# EAGLE schematic main (EAGLE 9.0.1)
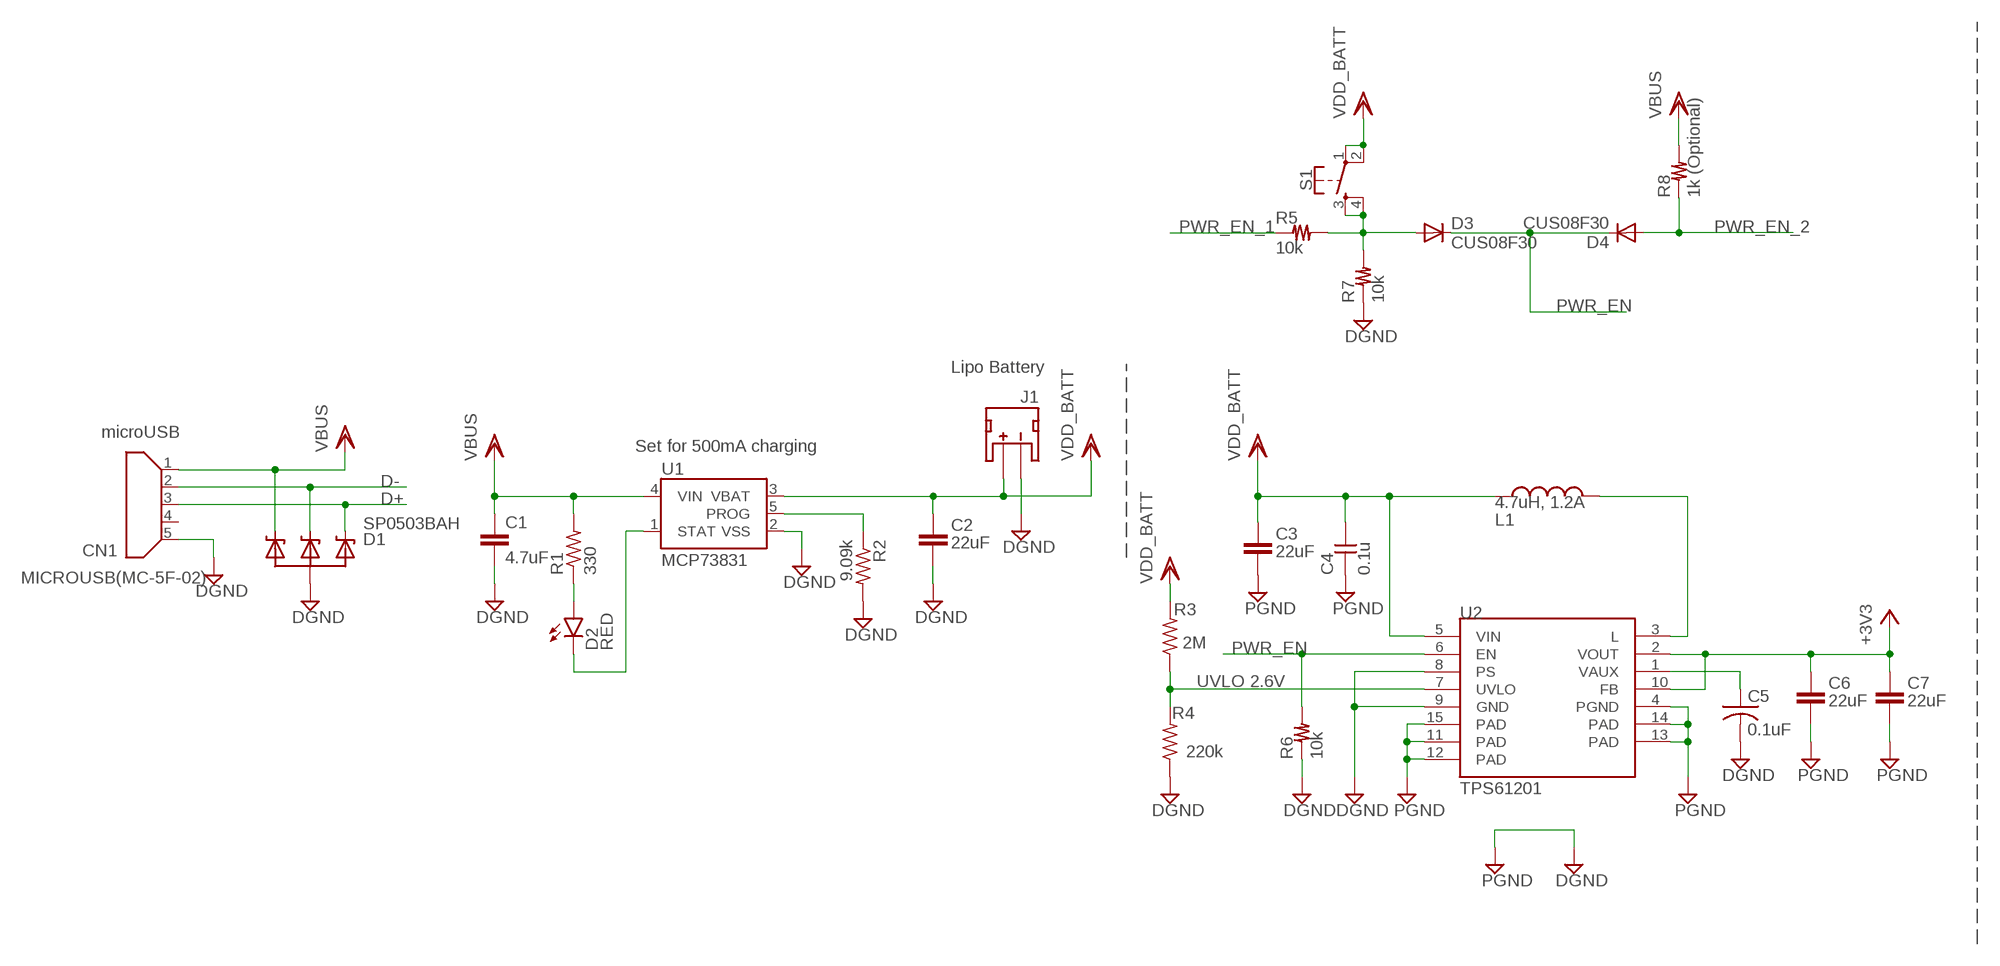
[diagram p0: schematic, sheet 1, part 1 of 2]
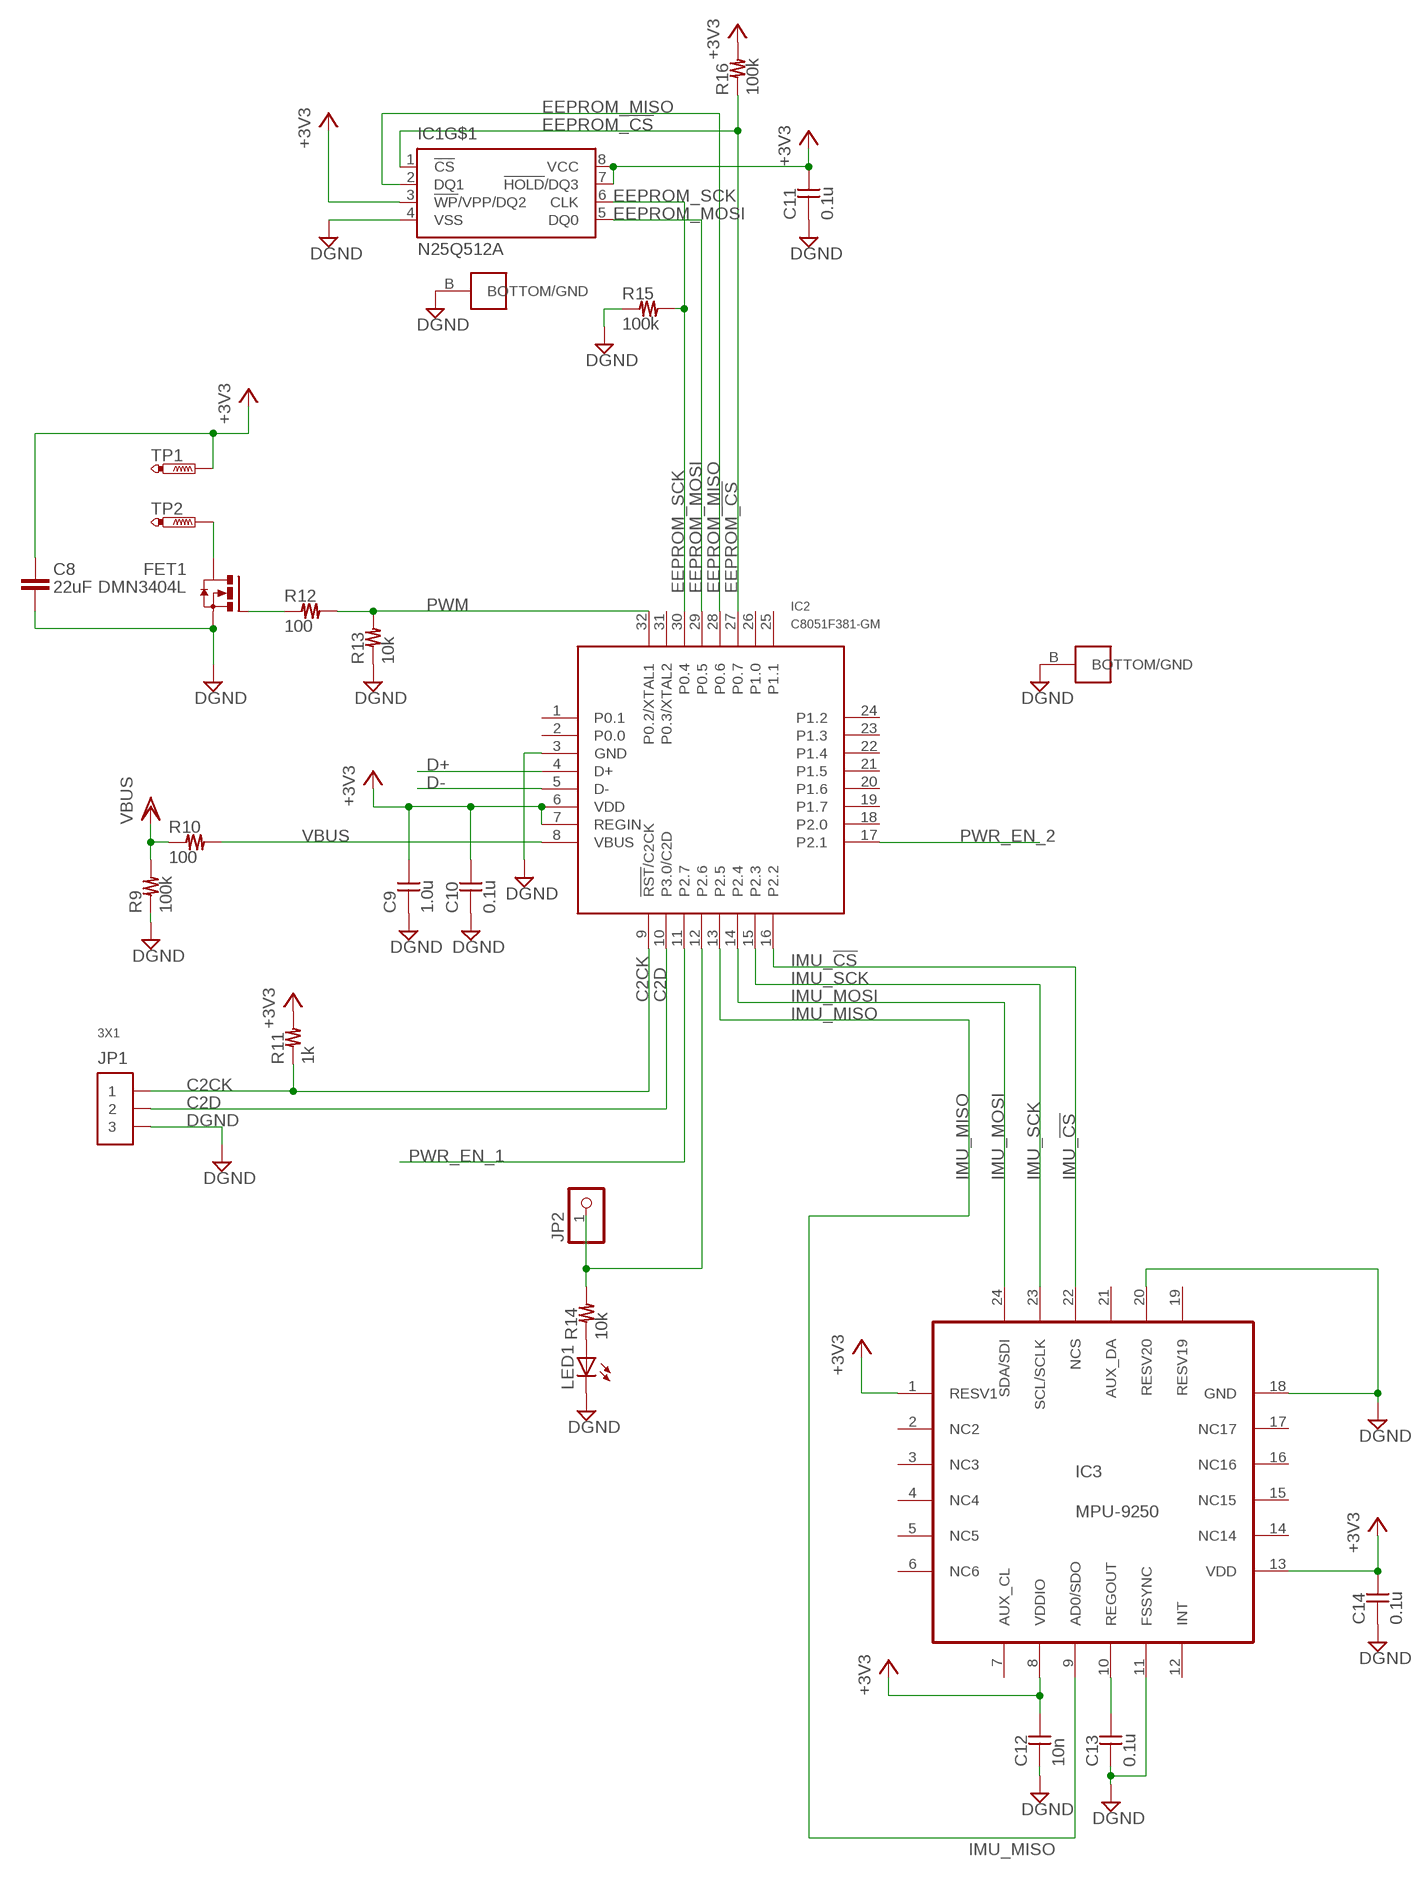
[diagram p1: schematic, sheet 1, part 2 of 2]

## Parts
C1  4.7uF  4.7UF-6.3V-10%(0603)0603  [0603-CAP]
C2  22uF  CAP0805  [0805]
C3  22uF  CAP0805  [0805]
C4  0.1u  C-1005  [1005]
C5  0.1uF  C-USC0402K  [C0402K]
C6  22uF  CAP0805  [0805]
C7  22uF  CAP0805  [0805]
C8  22uF  CAP0805  [0805]
C9  1.0u  C-1005  [1005]
C10  0.1u  C-1005  [1005]
C11  0.1u  C-1005  [1005]
C12  10n  C-1005  [1005]
C13  0.1u  C-1005  [1005]
C14  0.1u  C-1005  [1005]
CN1  MICROUSB(MC-5F-02)  [MICROUSB(MC-5F-02)]
D1  SP0503BAH  [SOT143]
D2  RED  LED-RED0603  [LED-0603]
D3  CUS08F30  DIODE-SOD323-W  [SOD323-W]
D4  CUS08F30  DIODE-SOD323-W  [SOD323-W]
FET1  DMN3404L  [SOT23]
IC1  N25Q512A  [V-PDFN-8]
IC2  C8051F381-GM  [QFN32]
IC3  MPU-9250  [QFN-24]
J1  JST  JST_2MM_MALE  [JST-2-SMD]
JP1  3X1  [MA3-1]
JP2  PINHD-1X1  [1X01]
L1  4.7uH, 1.2A  INDUCTOR.  [CDRH2D09]
LED1  LED1608O  [1608-OLI]
R1  330  R-US_R0402  [R0402]
R2  9.09k  R-US_R0402  [R0402]
R3  2M  R-US_R0402  [R0402]
R4  220k  R-US_R0402  [R0402]
R5  10k  R-1005  [1005]
R6  10k  R-1005  [1005]
R7  10k  R-1005  [1005]
R8  1k (Optional)  R-1005  [1005]
R9  100k  R-1005  [1005]
R10  100  R-1005  [1005]
R11  1k  R-1005  [1005]
R12  100  R-1005  [1005]
R13  10k  R-1005  [1005]
R14  10k  R-1005  [1005]
R15  100k  R-1005  [1005]
R16  100k  R-1005  [1005]
S1  MOMENTARY-SWITCH-SPST-2-SMD-4.6X2.8MM  [TACTILE_SWITCH_SMD_4.6X2.8MM]
TP1  PTR1TP10R  [TP10R]
TP2  PTR1TP10R  [TP10R]
U1  MCP73831  [SOT23-5]
U2  TPS61201  TPS61200  [QFN-10_PAD]

## Nets
+3V3 [PWR]: C6.1 C7.1 C8.1 C9.P$2 C10.P$2 C11.P$2 C12.P$2 C14.P$2 IC1.3(!WP!/VPP/DQ2) IC1.7(!HOLD!/DQ3) IC1.8(VCC) IC2.6(VDD) IC2.7(REGIN) IC3.1(RESV1) IC3.8(VDDIO) IC3.13(VDD) R11.P$2 R16.P$2 TP1.TP U2.2(VOUT) U2.10(FB)
C2CK: IC2.9(!RST!/C2CK) JP1.1 R11.P$1
C2D: IC2.10(P3.0/C2D) JP1.2
D+: CN1.3 D1.2 IC2.4(D+)
D-: CN1.2 D1.3 IC2.5(D-)
DGND: C1.2 C2.2 C3.2 C4.P$1 C5.2 C6.2 C7.2 C8.2 C9.P$1 C10.P$1 C11.P$1 C12.P$1 C13.P$1 C14.P$1 CN1.5 D1.1 FET1.S IC1.4(VSS) IC1.B(BOTTOM/GND) IC2.3(GND) IC2.B(BOTTOM/GND) IC3.11(FSSYNC) IC3.18(GND) IC3.20(RESV20) J1.1(-) JP1.3 LED1.K R2.2 R4.1 R6.P$1 R7.P$1 R9.P$1 R13.P$1 R15.P$1 U1.2(VSS) U2.4(PGND) U2.8(PS) U2.9(GND) U2.11(PAD) U2.12(PAD) U2.13(PAD) U2.14(PAD) U2.15(PAD) ; supply symbol labelled PGND
EEPROM_!CS: IC1.1(!CS) IC2.27(P0.7) R16.P$1
EEPROM_MISO: IC1.2(DQ1) IC2.28(P0.6)
EEPROM_MOSI: IC1.5(DQ0) IC2.29(P0.5)
EEPROM_SCK: IC1.6(CLK) IC2.30(P0.4) R15.P$2
IMU_!CS: IC2.16(P2.2) IC3.22(NCS)
IMU_MISO: IC2.13(P2.5) IC3.9(AD0/SDO)
IMU_MOSI: IC2.14(P2.4) IC3.24(SDA/SDI)
IMU_SCK: IC2.15(P2.3) IC3.23(SCL/SCLK)
LIN [PWR]: L1.P$1 U2.3(L)
N$3: D2.A R1.1
N$8: FET1.G R12.P$1
N$9: LED1.A R14.P$1
N$10: FET1.D TP2.TP
N$11: D3.A R5.P$2 R7.P$2 S1.3 S1.4
N$13: C13.P$2 IC3.10(REGOUT)
N$15: IC2.12(P2.6) JP2.1 R14.P$2
N$18: IC2.8(VBUS) R10.P$2
PROG: R2.1 U1.5(PROG)
PWM: IC2.32(P0.2/XTAL1) R12.P$2 R13.P$2
PWR_EN: D3.C D4.C R6.P$2 U2.6(EN)
PWR_EN_1: IC2.11(P2.7) R5.P$1
PWR_EN_2: D4.A IC2.17(P2.1) R8.P$1
STAT: D2.C U1.1(STAT)
UVLO: R3.1 R4.2 U2.7(UVLO)
VAUX: C5.1 U2.1(VAUX)
VBUS: C1.1 CN1.1 D1.4 R1.2 R8.P$2 R9.P$2 R10.P$1 U1.4(VIN)
VDD_BATT: C2.1 C3.1 C4.P$2 J1.2(+) L1.P$2 R3.2 S1.1 S1.2 U1.3(VBAT) U2.5(VIN)
Unconnected: CN1.4 IC2.1(P0.1) IC2.2(P0.0) IC2.18(P2.0) IC2.19(P1.7) IC2.20(P1.6) IC2.21(P1.5) IC2.22(P1.4) IC2.23(P1.3) IC2.24(P1.2) IC2.25(P1.1) IC2.26(P1.0) IC2.31(P0.3/XTAL2) IC3.2(NC2) IC3.3(NC3) IC3.4(NC4) IC3.5(NC5) IC3.6(NC6) IC3.7(AUX_CL) IC3.12(INT) IC3.14(NC14) IC3.15(NC15) IC3.16(NC16) IC3.17(NC17) IC3.19(RESV19) IC3.21(AUX_DA) J1.NC1(PAD1) J1.NC2(PAD2)

## Notes on the sheet
- Lipo Battery
- microUSB
- Set for 500mA charging
- UVLO 2.6V

## Library data of the parts
C1 = SparkFun-Capacitors:4.7UF-6.3V-10%(0603): CAP-08280; PROD_ID: CAP-08280
C2 C3 C6-C8 = CH_passive:CAP: Capacitor Standard 0603 ceramic capacitor, and 0.1" leaded capacitor.
C4 C9-C14 = reg,cap:C-
C5 = rcl:C-US: CAPACITOR, American symbol; SPICEPREFIX: C
CN1 = Connector:MICROUSB(MC-5F-02)
D1 = diode:SP0503BAH
D2 = SparkFun-LED:LED-RED: Assorted Red LEDs LilyPad 1206- DIO-09912 1206- DIO-00809 0603- DIO-00819; PROD_ID: DIO-00819
D3 D4 = diode:DIODE-: DIODE
FET1 = MOSFET:DMN3404L
IC1 = EEPROM:N25Q512A
IC2 = C8051F34x:C8051F381-GM
IC3 = GYRO:MPU-9250
J1 = SparkFun-Connectors:JST_2MM_MALE: Mates to single-cell LiPo batteries. CONN-08352; PROD_ID: CONN-08352
JP1 = pin_header:3X1
JP2 = pinhead:PINHD-1X1: PIN HEADER
L1 = SparkFun:INDUCTOR: Inductors Basic Inductor/Choke - 0603 and 1206. Footprints are not proven and vary greatly between part numbers.
LED1 = LED:LED
R1-R4 = rcl:R-US_: RESISTOR, American symbol; SPICEPREFIX: R
R5-R16 = reg,cap:R-
S1 = SparkFun-Switches:MOMENTARY-SWITCH-SPST-2: Momentary Switch (Pushbutton) - SPST - Two Circuits Normally-open (NO) SPST momentary switches (buttons, pushbuttons). Schematic symbol includes two switch circuits. Variants SMD-4.6MMX2.8MM - 4.60mm x 2.80mm Tactile Momentary Button Switch - Used on SparkFun SAMD21 Mini Breakout <https://www.sparkfun.com/products/13664> SMD-5.2MM - Mini Pushbutton Switch - SMD <https://www.sparkfun.com/products/8720> - Used on Arduino Pro Mini <https://www.sparkfun.com/products/11114>; PROD_ID: SWCH-13065
TP1 TP2 = testpad:PTR1: TEST PIN
U1 = SparkFun-PowerIC:MCP73831: Miniature single cell, fully integrated Li-Ion, Li-polymer charge management controller http://ww1.microchip.com/downloads/en/DeviceDoc/21984a.pdf IC-09995; PROD_ID: IC-09995
U2 = SparkFun:TPS61200: DC to DC Booster